# Altium schematic sheet 0274_GPU STRAPS-3.SchDoc
size 848 x 558 mm
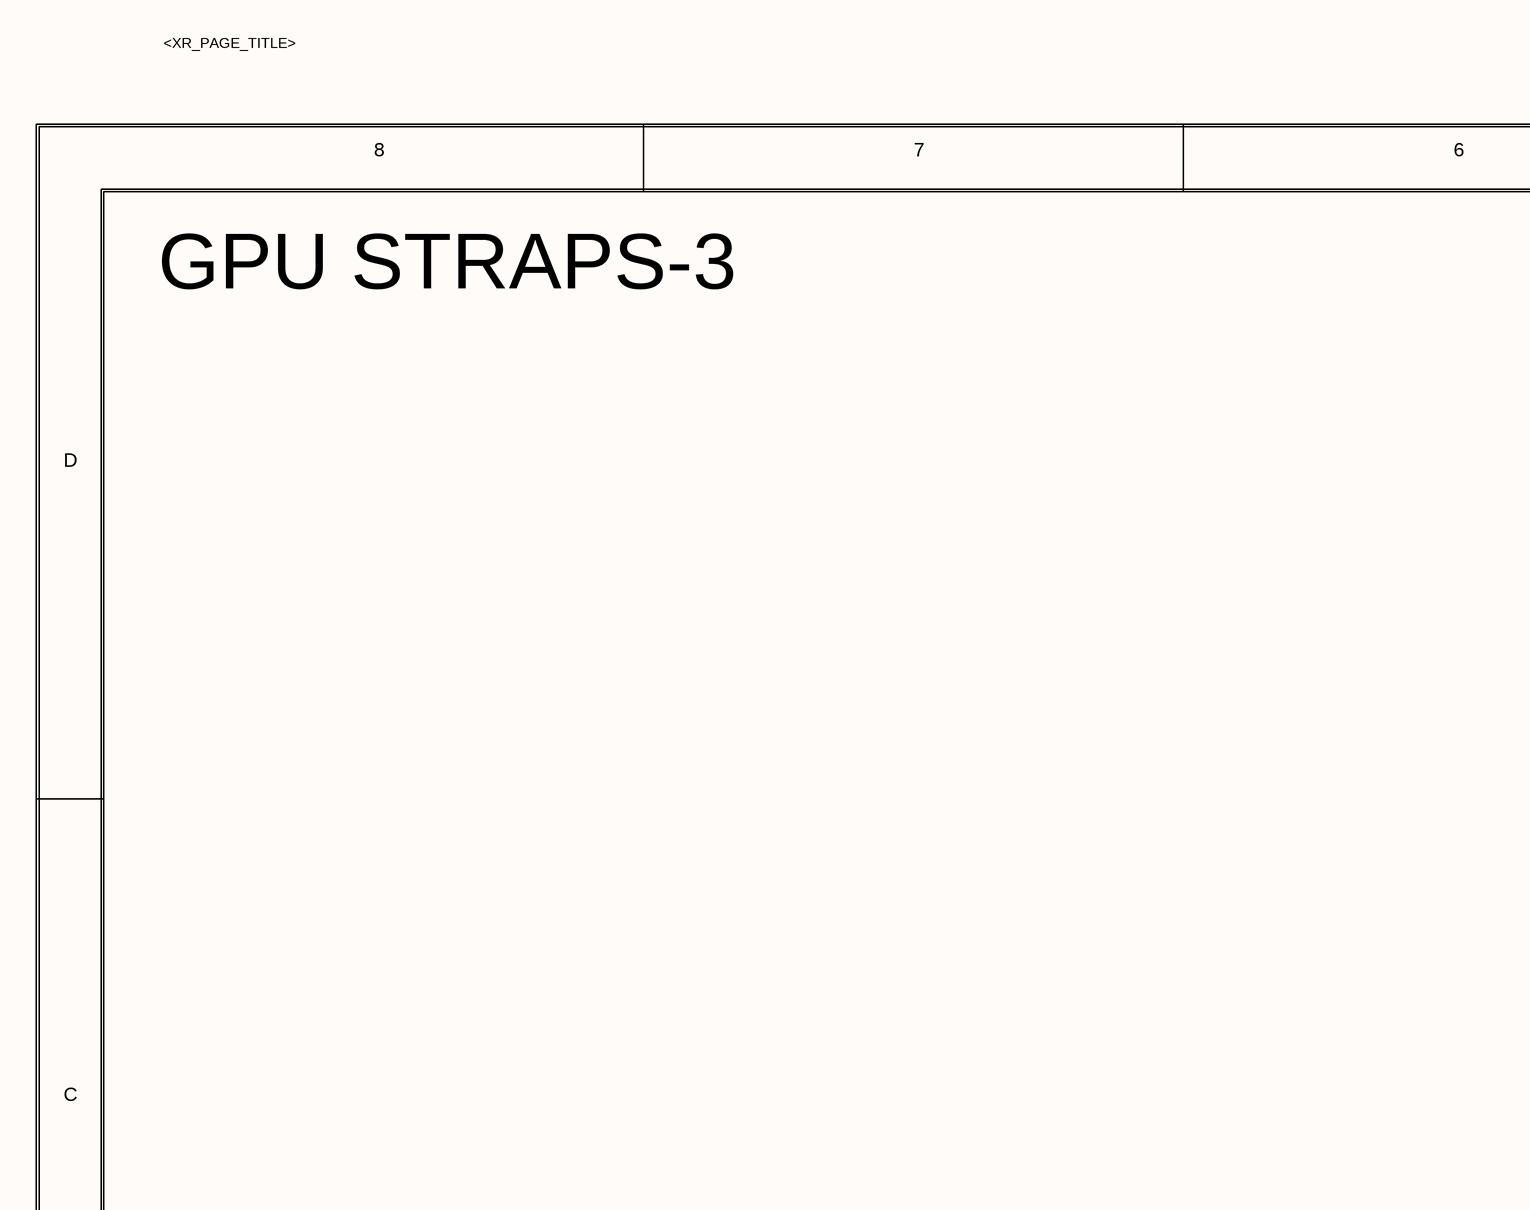
[diagram p0: 0274_GPU STRAPS-3.SchDoc, top left]
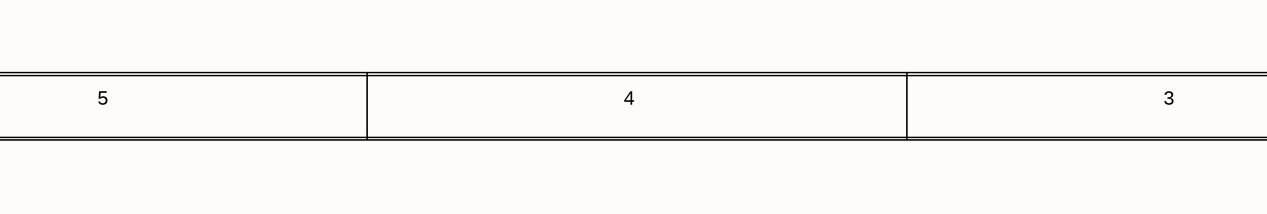
[diagram p1: 0274_GPU STRAPS-3.SchDoc, top middle]
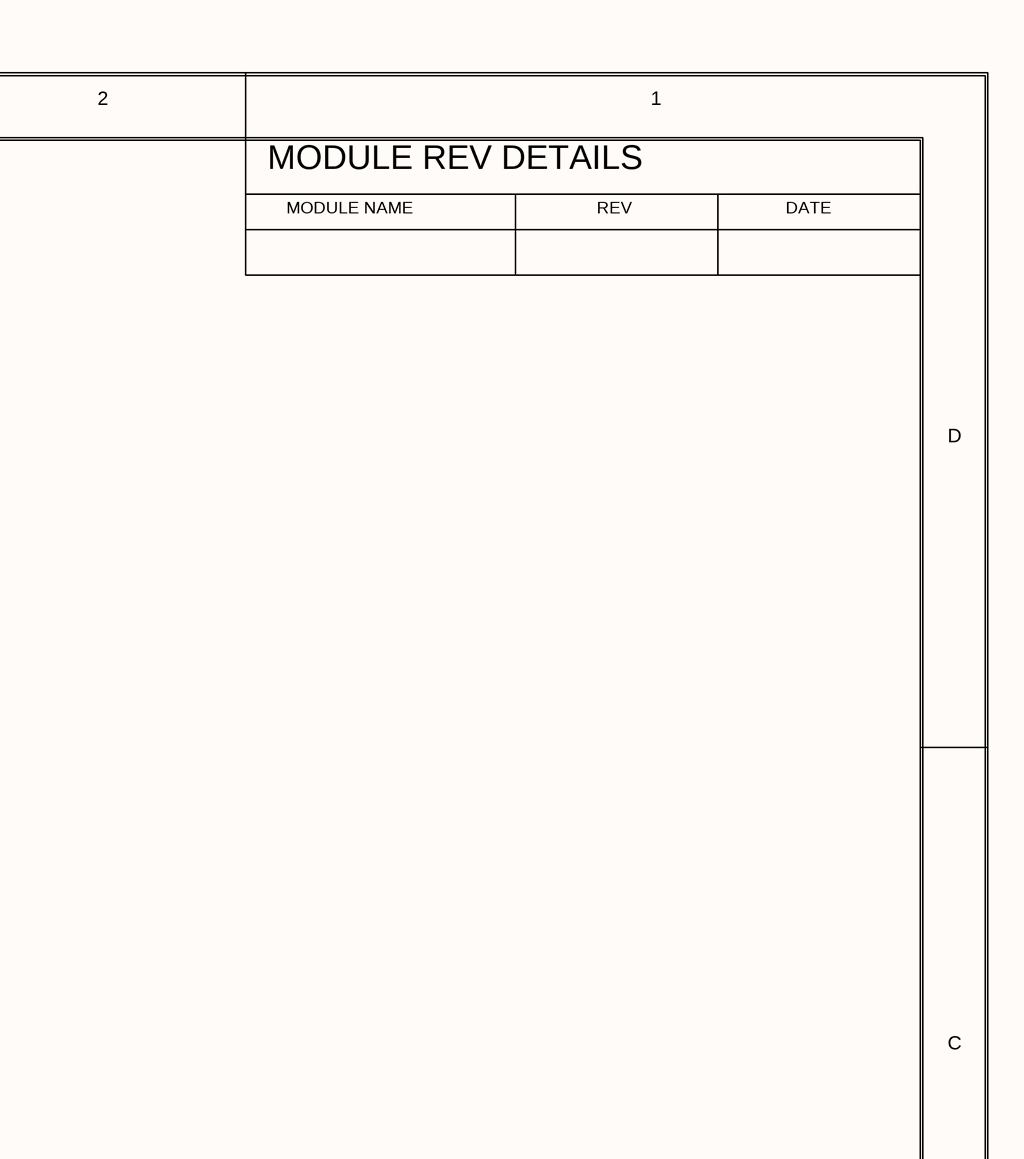
[diagram p2: 0274_GPU STRAPS-3.SchDoc, top right]
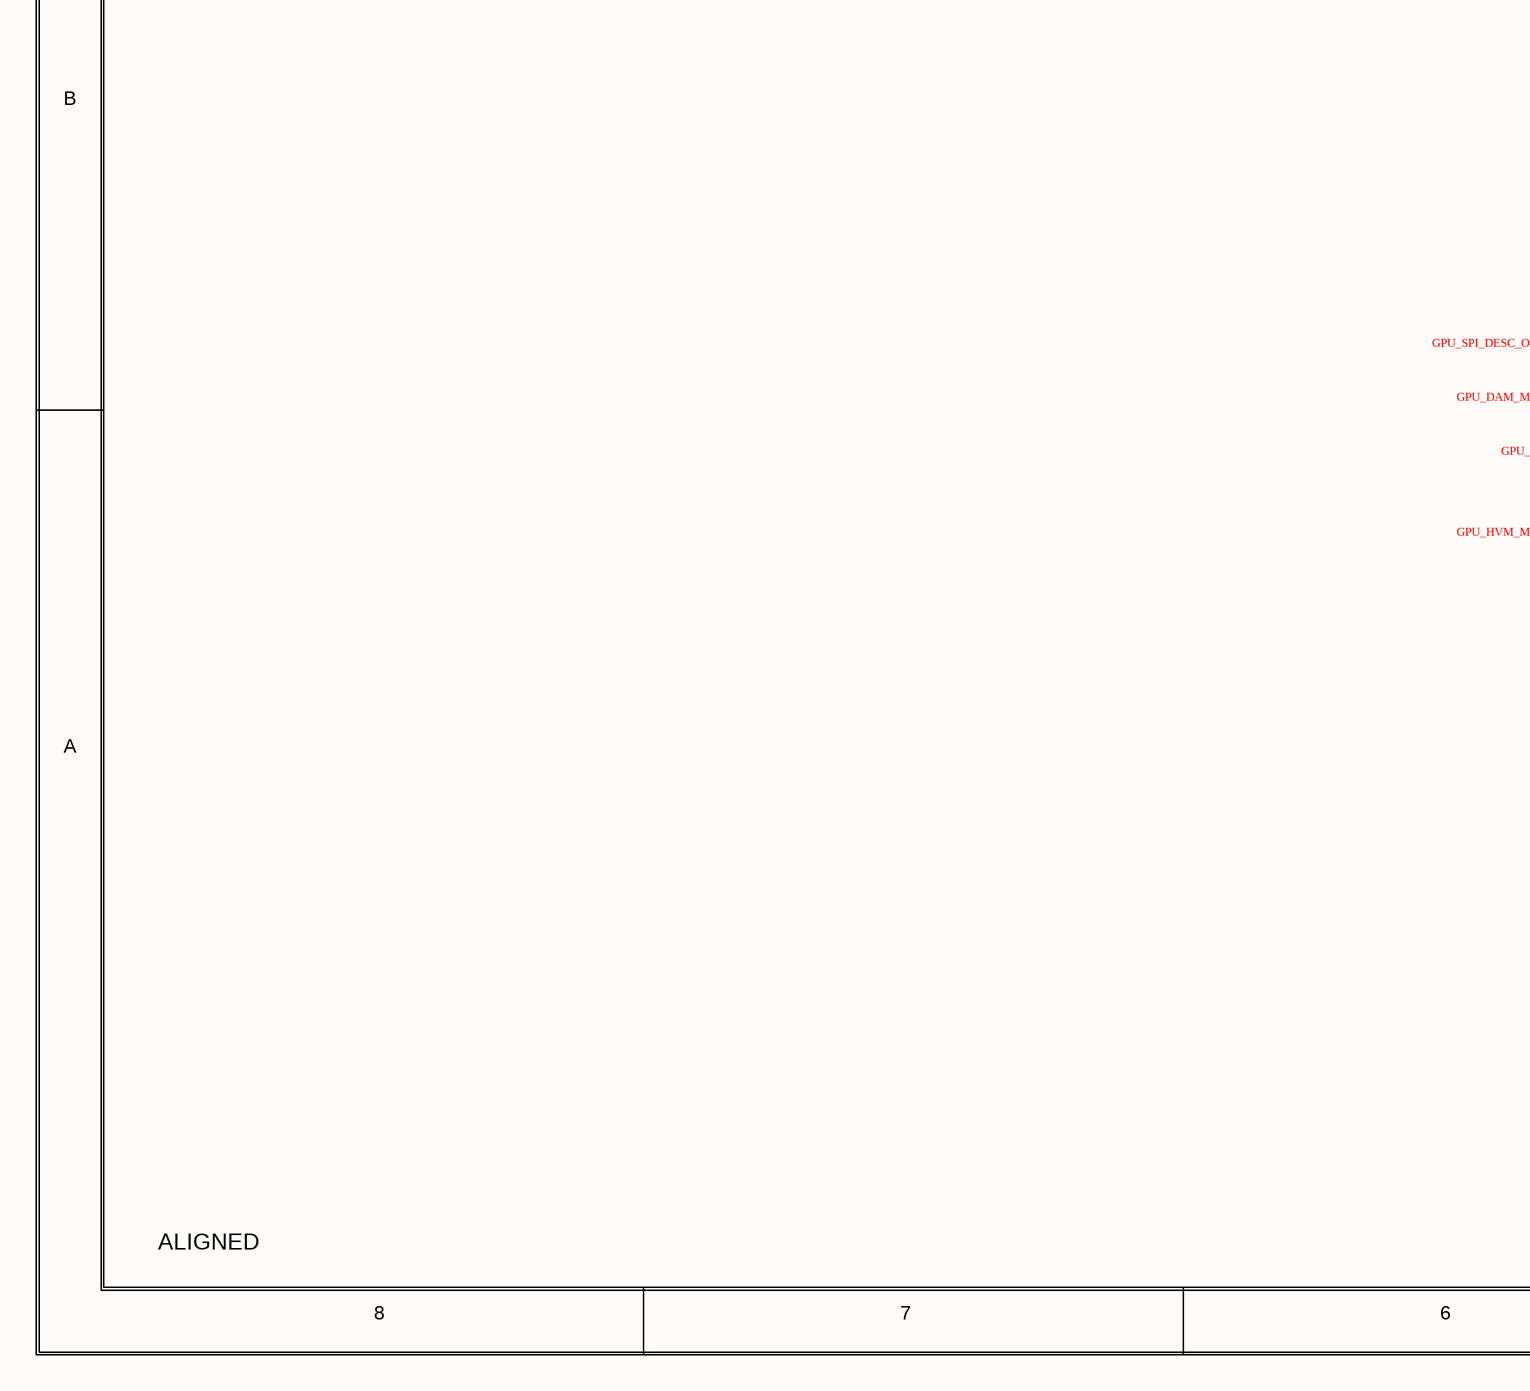
[diagram p3: 0274_GPU STRAPS-3.SchDoc, bottom left]
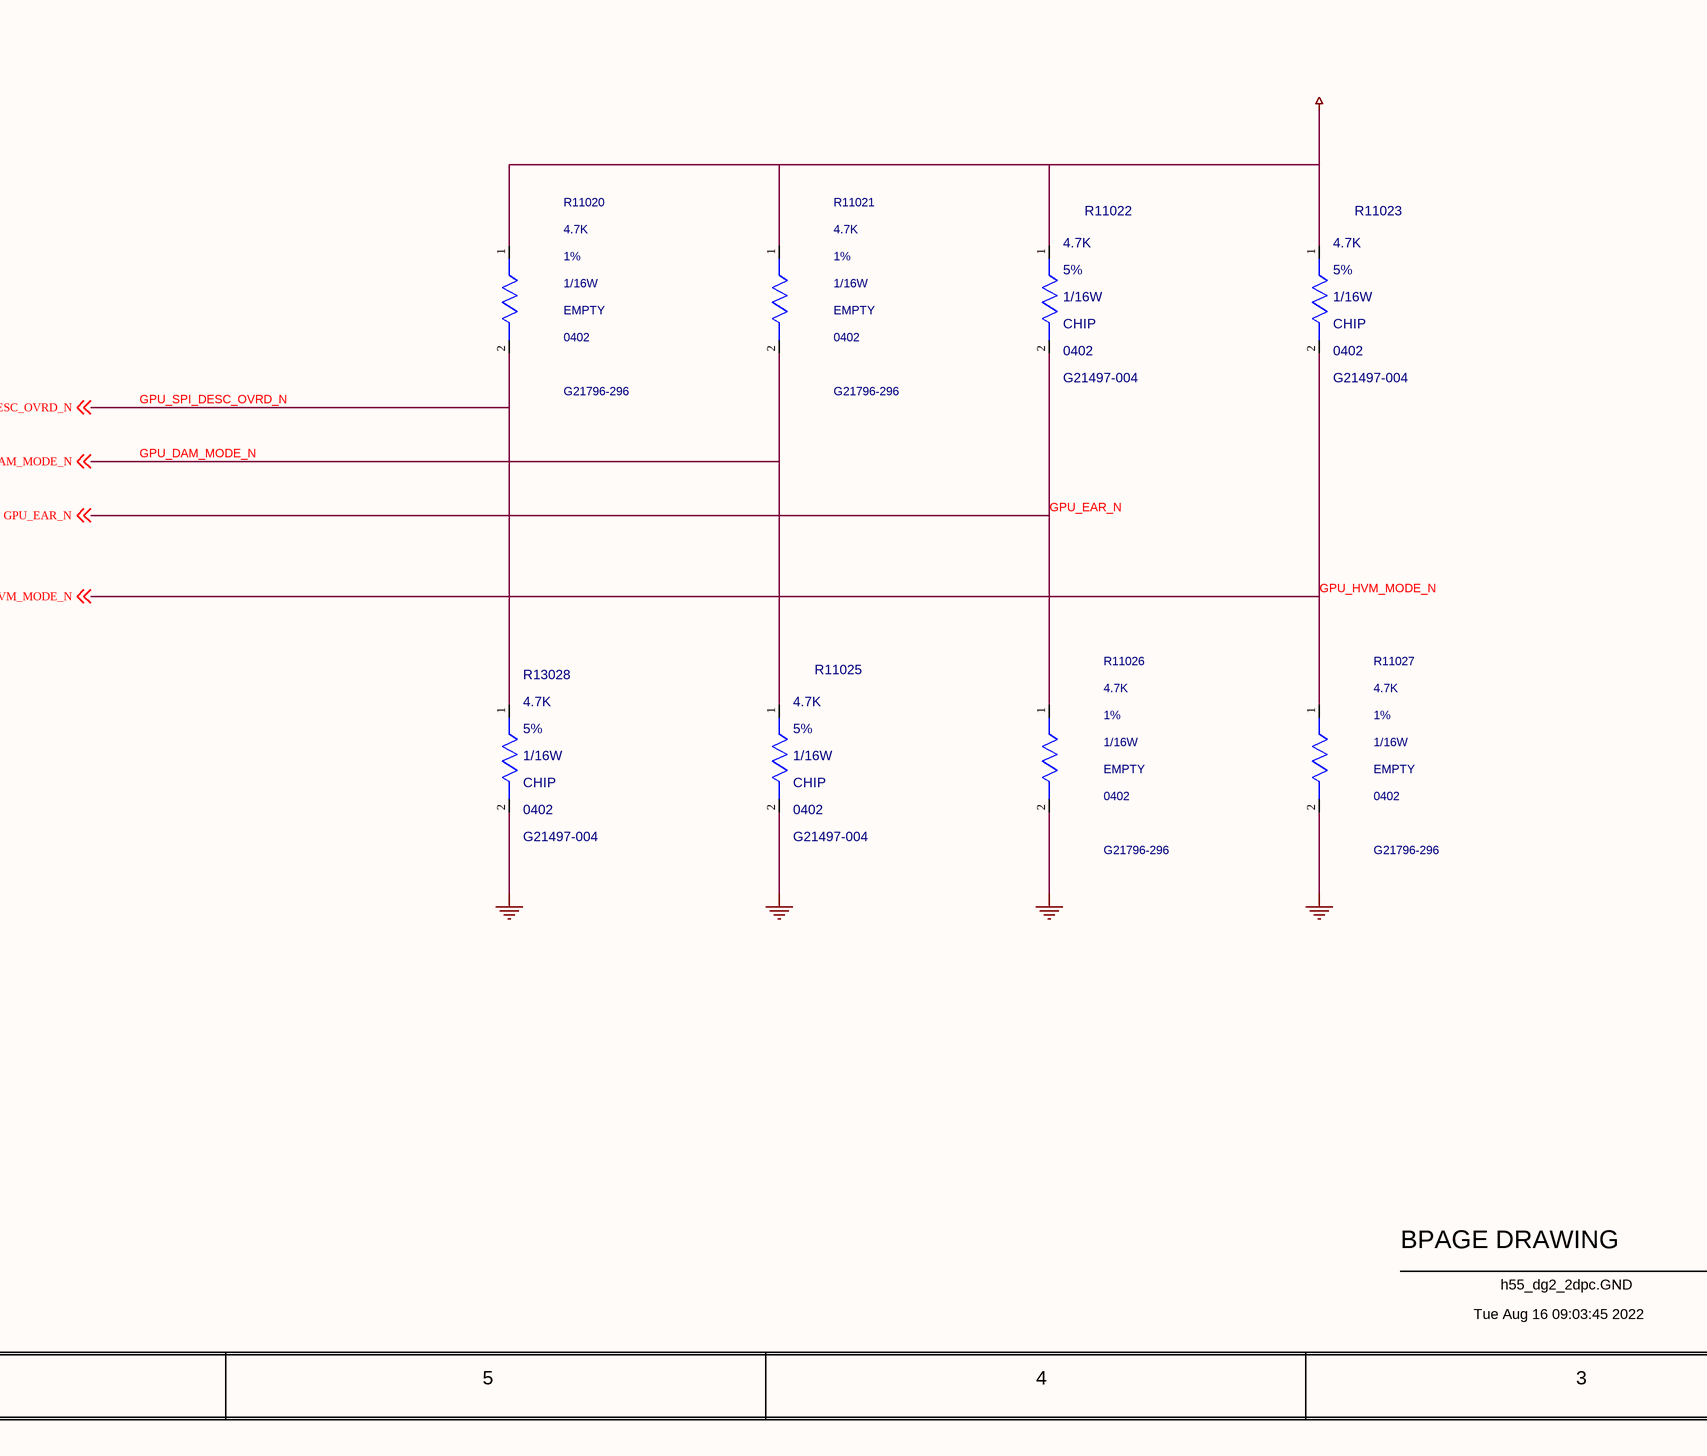
[diagram p4: 0274_GPU STRAPS-3.SchDoc, bottom middle]
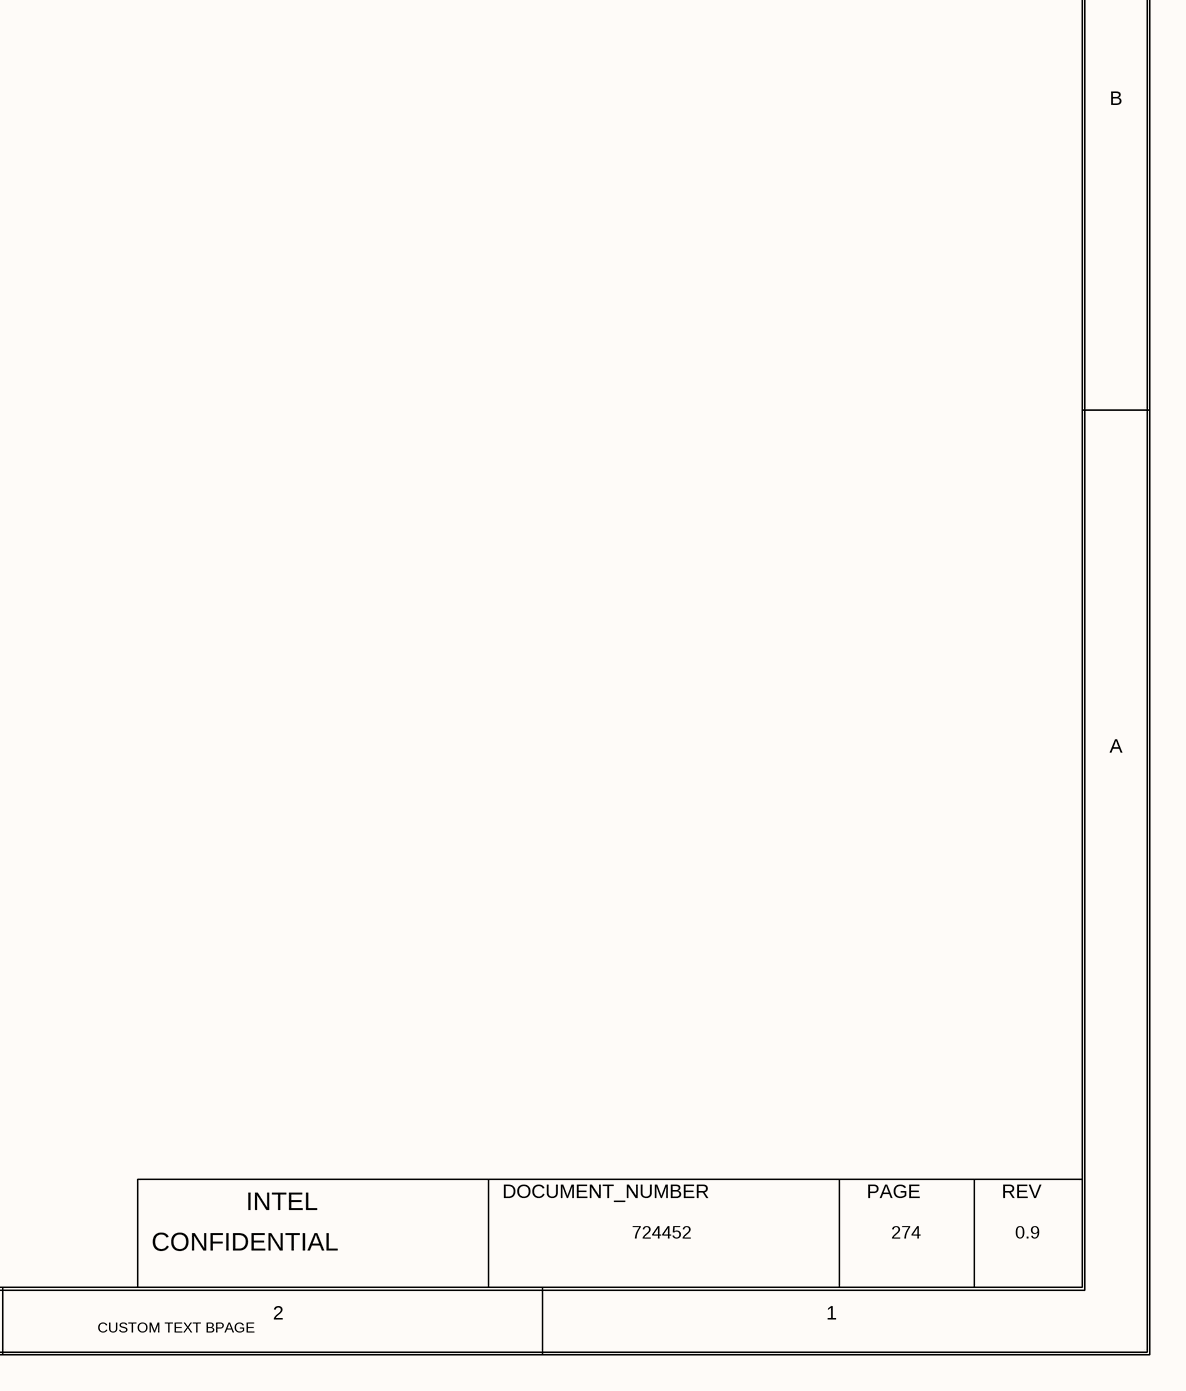
[diagram p5: 0274_GPU STRAPS-3.SchDoc, bottom right]

## Parts
R11020  4.7K  MATERIAL: EMPTY  PACK_TYPE: 0402  PART_NUMBER: G21796-296  TOLERANCE: 1%  WATTAGE: 1/16W  [SMR0402IA]
R11021  4.7K  MATERIAL: EMPTY  PACK_TYPE: 0402  PART_NUMBER: G21796-296  TOLERANCE: 1%  WATTAGE: 1/16W  [SMR0402IA]
R11022  4.7K  MATERIAL: CHIP  PACK_TYPE: 0402  PART_NUMBER: G21497-004  TOLERANCE: 5%  WATTAGE: 1/16W  [SMR0402IA]
R11023  4.7K  MATERIAL: CHIP  PACK_TYPE: 0402  PART_NUMBER: G21497-004  TOLERANCE: 5%  WATTAGE: 1/16W  [SMR0402IA]
R11025  4.7K  MATERIAL: CHIP  PACK_TYPE: 0402  PART_NUMBER: G21497-004  TOLERANCE: 5%  WATTAGE: 1/16W  [SMR0402IA]
R11026  4.7K  MATERIAL: EMPTY  PACK_TYPE: 0402  PART_NUMBER: G21796-296  TOLERANCE: 1%  WATTAGE: 1/16W  [SMR0402IA]
R11027  4.7K  MATERIAL: EMPTY  PACK_TYPE: 0402  PART_NUMBER: G21796-296  TOLERANCE: 1%  WATTAGE: 1/16W  [SMR0402IA]
R13028  4.7K  MATERIAL: CHIP  PACK_TYPE: 0402  PART_NUMBER: G21497-004  TOLERANCE: 5%  WATTAGE: 1/16W  [SMR0402IA]

## Nets
+V1P8S_GPU: R11020.1(A) R11021.1(A) R11022.1(A) R11023.1(A)
GND: R11025.2(B) R11026.2(B) R11027.2(B) R13028.2(B)
GPU_DAM_MODE_N: R11021.2(B) R11025.1(A) ; off-sheet GPU_DAM_MODE_N
GPU_EAR_N: R11022.2(B) R11026.1(A) ; off-sheet GPU_EAR_N
GPU_HVM_MODE_N: R11023.2(B) R11027.1(A) ; off-sheet GPU_HVM_MODE_N
GPU_SPI_DESC_OVRD_N: R11020.2(B) R13028.1(A) ; off-sheet GPU_SPI_DESC_OVRD_N

## Notes on the sheet
- <XR_PAGE_TITLE>
- 8
- 7
- 6
- 5
- 4
- 3
- 2
- 1
- MODULE REV DETAILS
- GPU STRAPS-3
- MODULE NAME
- REV
- DATE
- D
- C
- B
- A
- BPAGE DRAWING
- INTEL
- DOCUMENT_NUMBER
- PAGE
- ALIGNED
- Tue Aug 16 09:03:45 2022
- h55_dg2_2dpc.GND
- CONFIDENTIAL
- 724452
- 274
- 0.9
- CUSTOM TEXT BPAGE

## Library data of the parts
R11020 = RES: CDS_PHYS_PART_NAME: RES_0402-G21796-296,EMPTY,4.7K,1%,1/16W,LPDB,GENERIC; OriginalSymbolOrigin: (-25,75); XY: (-4475,1950); VER: 2; ROT: 0; PHYS_PAGE: 274; LOCATION: R11020; DRAWING: @RVP1_ADL_SB_ADP_S_DDR5_SODIMM_2DPC_LIB.H55_DG2_2DPC(SCH_1):PAGE447; CDS_LIB: discrete; PCB Footprint: SMR0402IA; CHIPS_PART_NAME: RES; CDS_PART_NAME: RES_0402-G21796-296,EMPTY,4.7K,1%,1/16W,LPDB,GENERIC; CDS_LOCATION: R11020
R11021 = RES: CDS_PHYS_PART_NAME: RES_0402-G21796-296,EMPTY,4.7K,1%,1/16W,LPDB,GENERIC; OriginalSymbolOrigin: (-25,75); XY: (-3975,1950); VER: 2; ROT: 0; PHYS_PAGE: 274; LOCATION: R11021; DRAWING: @RVP1_ADL_SB_ADP_S_DDR5_SODIMM_2DPC_LIB.H55_DG2_2DPC(SCH_1):PAGE447; CDS_LIB: discrete; PCB Footprint: SMR0402IA; CHIPS_PART_NAME: RES; CDS_PART_NAME: RES_0402-G21796-296,EMPTY,4.7K,1%,1/16W,LPDB,GENERIC; CDS_LOCATION: R11021
R11022 = RES: CDS_PHYS_PART_NAME: RES_0402-G21497-004,CHIP,4.7K,5%,1/16W,LPDB,GENERIC; OriginalSymbolOrigin: (-25,75); XY: (-3475,1950); VER: 2; ROT: 0; PHYS_PAGE: 274; LOCATION: R11022; IP: GENERIC; FP_TECH: LPDB; DRAWING: @RVP1_ADL_SB_ADP_S_DDR5_SODIMM_2DPC_LIB.H55_DG2_2DPC(SCH_1):PAGE447; CDS_LIB: discrete; PCB Footprint: SMR0402IA; CHIPS_PART_NAME: RES; CDS_PART_NAME: RES_0402-G21497-004,CHIP,4.7K,5%,1/16W,LPDB,GENERIC; CDS_LOCATION: R11022
R11023 = RES: CDS_PHYS_PART_NAME: RES_0402-G21497-004,CHIP,4.7K,5%,1/16W,LPDB,GENERIC; OriginalSymbolOrigin: (-25,75); XY: (-2975,1950); VER: 2; ROT: 0; PHYS_PAGE: 274; LOCATION: R11023; IP: GENERIC; FP_TECH: LPDB; DRAWING: @RVP1_ADL_SB_ADP_S_DDR5_SODIMM_2DPC_LIB.H55_DG2_2DPC(SCH_1):PAGE447; CDS_LIB: discrete; PCB Footprint: SMR0402IA; CHIPS_PART_NAME: RES; CDS_PART_NAME: RES_0402-G21497-004,CHIP,4.7K,5%,1/16W,LPDB,GENERIC; CDS_LOCATION: R11023
R11025 = RES: CDS_PHYS_PART_NAME: RES_0402-G21497-004,CHIP,4.7K,5%,1/16W,LPDB,GENERIC; OriginalSymbolOrigin: (-25,75); XY: (-3975,1100); VER: 2; ROT: 0; PHYS_PAGE: 274; LOCATION: R11025; IP: GENERIC; FP_TECH: LPDB; DRAWING: @RVP1_ADL_SB_ADP_S_DDR5_SODIMM_2DPC_LIB.H55_DG2_2DPC(SCH_1):PAGE447; CDS_LIB: discrete; PCB Footprint: SMR0402IA; CHIPS_PART_NAME: RES; CDS_PART_NAME: RES_0402-G21497-004,CHIP,4.7K,5%,1/16W,LPDB,GENERIC; CDS_LOCATION: R11025
R11026 = RES: CDS_PHYS_PART_NAME: RES_0402-G21796-296,EMPTY,4.7K,1%,1/16W,LPDB,GENERIC; OriginalSymbolOrigin: (-25,75); XY: (-3475,1100); VER: 2; ROT: 0; PHYS_PAGE: 274; LOCATION: R11026; DRAWING: @RVP1_ADL_SB_ADP_S_DDR5_SODIMM_2DPC_LIB.H55_DG2_2DPC(SCH_1):PAGE447; CDS_LIB: discrete; PCB Footprint: SMR0402IA; CHIPS_PART_NAME: RES; CDS_PART_NAME: RES_0402-G21796-296,EMPTY,4.7K,1%,1/16W,LPDB,GENERIC; CDS_LOCATION: R11026
R11027 = RES: CDS_PHYS_PART_NAME: RES_0402-G21796-296,EMPTY,4.7K,1%,1/16W,LPDB,GENERIC; OriginalSymbolOrigin: (-25,75); XY: (-2975,1100); VER: 2; ROT: 0; PHYS_PAGE: 274; LOCATION: R11027; DRAWING: @RVP1_ADL_SB_ADP_S_DDR5_SODIMM_2DPC_LIB.H55_DG2_2DPC(SCH_1):PAGE447; CDS_LIB: discrete; PCB Footprint: SMR0402IA; CHIPS_PART_NAME: RES; CDS_PART_NAME: RES_0402-G21796-296,EMPTY,4.7K,1%,1/16W,LPDB,GENERIC; CDS_LOCATION: R11027
R13028 = RES: CDS_PHYS_PART_NAME: RES_0402-G21497-004,CHIP,4.7K,5%,1/16W,LPDB,GENERIC; OriginalSymbolOrigin: (-25,75); XY: (-4475,1100); VER: 2; ROT: 0; PHYS_PAGE: 274; LOCATION: R13028; IP: GENERIC; FP_TECH: LPDB; DRAWING: @RVP1_ADL_SB_ADP_S_DDR5_SODIMM_2DPC_LIB.H55_DG2_2DPC(SCH_1):PAGE447; CDS_LIB: discrete; PCB Footprint: SMR0402IA; CHIPS_PART_NAME: RES; CDS_PART_NAME: RES_0402-G21497-004,CHIP,4.7K,5%,1/16W,LPDB,GENERIC; CDS_LOCATION: R13028